# Altium schematic sheet Power.SchDoc
size A4
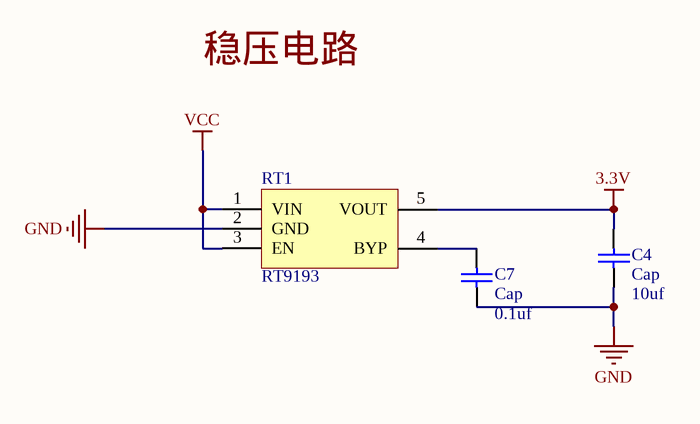
[diagram p0: Power.SchDoc]

## Parts
C4  Cap  value 10uf  [RESISTOR_0603]
C7  Cap  value 0.1uf  [CAP_CERAMIC_0402]
RT1  RT9193  [SOT23-5L]

## Nets
3.3V: C4.2 RT1.5(VOUT)
GND: C4.1 C7.1 RT1.2(GND)
VCC: RT1.1(VIN) RT1.3(EN)
NetC7_2: C7.2 RT1.4(BYP)

## Notes on the sheet
- Labels drawn without touching a wire or pin: 稳压电路

## Library data of the parts
C4 C7 = Cap: Capacitor; Published: 8-Jun-2000; LatestRevisionDate: 17-Jul-2002; LatestRevisionNote: Re-released for DXP Platform.; PackageReference: RAD-0.3; Publisher: Altium Limited; PackageDescription: Radial Cap, Thru-Hole; 2 Leads; 0.3 in Pin Spacing
RT1 = RT9193: Power